# EAGLE design HSHV4-student versionTester (EAGLE 7.2.0)
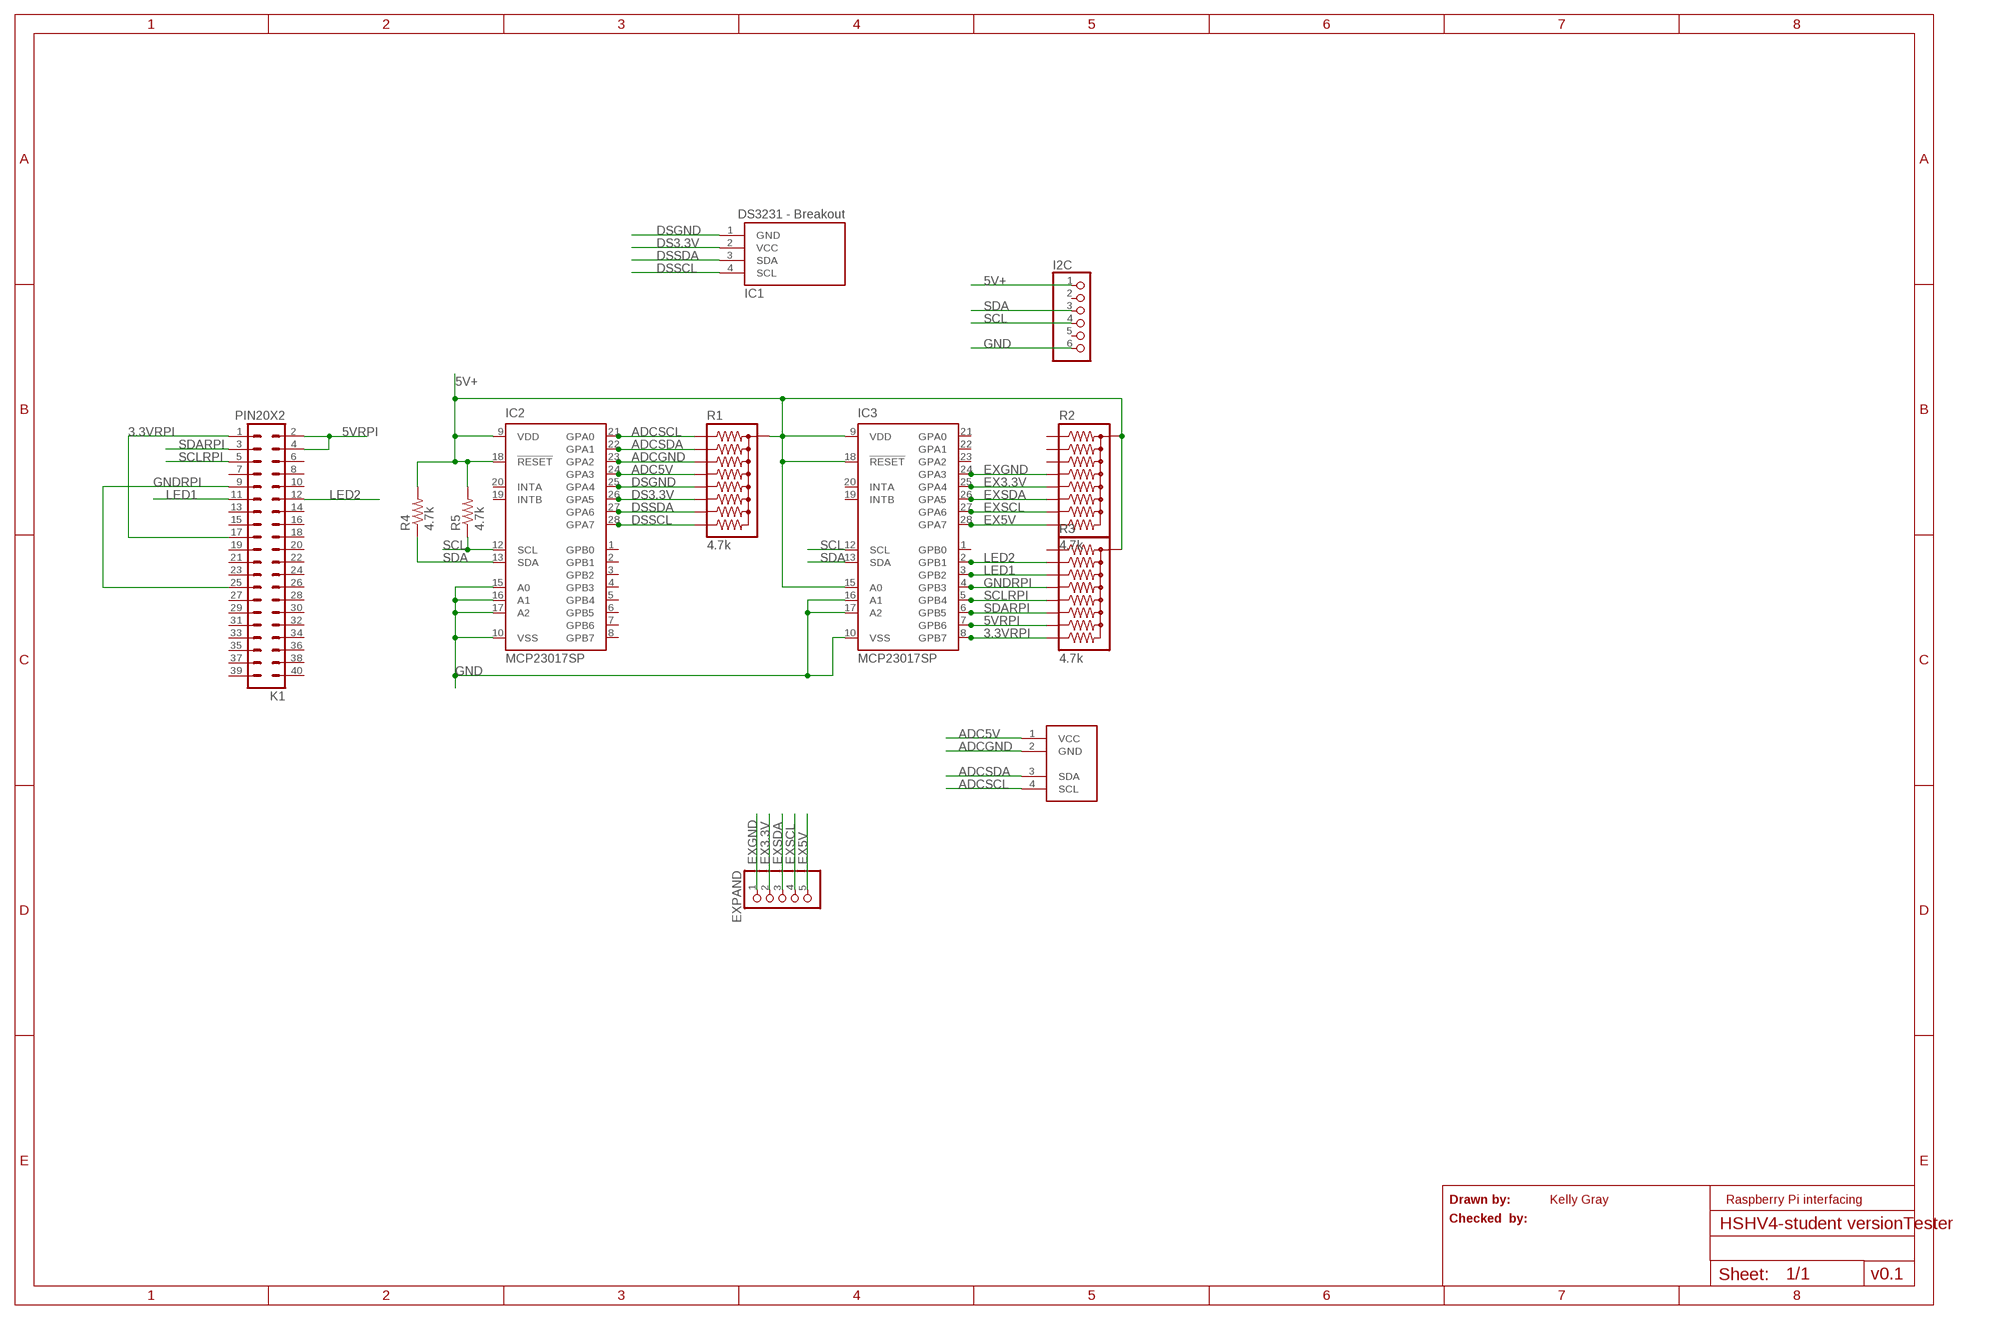
[diagram p0: schematic, sheet 1]

## Parts
EXPAND  PINHD-1X5  [1X05]
I2C  PINHD-1X6  [1X06]
IC1  DS3231  [8PTH]
IC2  MCP23017SP  [DIL28-3]
IC3  MCP23017SP  [DIL28-3]
K1  PIN20X2  [PIN_20X2]
R1  4.7k  RPACK-BUSSED-8-SIP-PTH-8  [RPACK-SIP-PTH-8]
R2  4.7k  RPACK-BUSSED-8-SIP-PTH-8  [RPACK-SIP-PTH-8]
R3  4.7k  RPACK-BUSSED-8-SIP-PTH-8  [RPACK-SIP-PTH-8]
R4  4.7k  R-US_0414/15  [0414/15]
R5  4.7k  R-US_0414/15  [0414/15]
U$1  PCF8591  [1X04]

## Nets
3.3VRPI: IC3.8(GPB7) K1.1 K1.17 R3.P$9
5V+: I2C.1 IC2.9(VDD) IC2.18(!RESET) IC3.9(VDD) IC3.15(A0) IC3.18(!RESET) R1.P$1 R2.P$1 R3.P$1 R4.2 R5.2
5VRPI: IC3.7(GPB6) K1.2 K1.4 R3.P$8
ADC5V: IC2.24(GPA3) R1.P$5 U$1.1(VCC)
ADCGND: IC2.23(GPA2) R1.P$4 U$1.2(GND)
ADCSCL: IC2.21(GPA0) R1.P$2 U$1.4(SCL)
ADCSDA: IC2.22(GPA1) R1.P$3 U$1.3(SDA)
DS3.3V: IC1.2(VCC) IC2.26(GPA5) R1.P$7
DSGND: IC1.1(GND) IC2.25(GPA4) R1.P$6
DSSCL: IC1.4(SCL) IC2.28(GPA7) R1.P$9
DSSDA: IC1.3(SDA) IC2.27(GPA6) R1.P$8
EX3.3V: EXPAND.2 IC3.25(GPA4) R2.P$6
EX5V: EXPAND.5 IC3.28(GPA7) R2.P$9
EXGND: EXPAND.1 IC3.24(GPA3) R2.P$5
EXSCL: EXPAND.4 IC3.27(GPA6) R2.P$8
EXSDA: EXPAND.3 IC3.26(GPA5) R2.P$7
GND: I2C.6 IC2.10(VSS) IC2.15(A0) IC2.16(A1) IC2.17(A2) IC3.10(VSS) IC3.16(A1) IC3.17(A2)
GNDRPI: IC3.4(GPB3) K1.9 K1.25 R3.P$5
LED1: IC3.3(GPB2) K1.11 R3.P$4
LED2: IC3.2(GPB1) K1.12 R3.P$3
SCL: I2C.4 IC2.12(SCL) IC3.12(SCL) R5.1
SCLRPI: IC3.5(GPB4) K1.5 R3.P$6
SDA: I2C.3 IC2.13(SDA) IC3.13(SDA) R4.1
SDARPI: IC3.6(GPB5) K1.3 R3.P$7
Unconnected: I2C.2 I2C.5 IC2.1(GPB0) IC2.2(GPB1) IC2.3(GPB2) IC2.4(GPB3) IC2.5(GPB4) IC2.6(GPB5) IC2.7(GPB6) IC2.8(GPB7) IC2.19(INTB) IC2.20(INTA) IC3.1(GPB0) IC3.19(INTB) IC3.20(INTA) IC3.21(GPA0) IC3.22(GPA1) IC3.23(GPA2) K1.6 K1.7 K1.8 K1.10 K1.13 K1.14 K1.15 K1.16 K1.18 K1.19 K1.20 K1.21 K1.22 K1.23 K1.24 K1.26 K1.27 K1.28 K1.29 K1.30 K1.31 K1.32 K1.33 K1.34 K1.35 K1.36 K1.37 K1.38 K1.39 K1.40 R2.P$2 R2.P$3 R2.P$4 R3.P$2

## Notes on the sheet
- Drawn by: | Kelly Gray | Raspberry Pi interfacing
- Checked  by:
- v0.1

## Library data of the parts
EXPAND = pinhead:PINHD-1X5: PIN HEADER
I2C = pinhead:PINHD-1X6: PIN HEADER
IC1 = SenseHat:DS3231
IC2 IC3 = adafruit:MCP23017: http://ww1.microchip.com/downloads/en/DeviceDoc/21952a.pdf Source: http://ww1.microchip.com/downloads/en/DeviceDoc/21952a.pdf
K1 = FLYFISH:PIN20X2
R1-R3 = SparkFun-Resistors:RPACK-BUSSED-8: BOURNS 4600X/R series thick-film SIP resistor packs Height resistors bussed to a single pin (denoted by dot). datasheet <http://dlnmh9ip6v2uc.cloudfront.net/datasheets/Components/General/4600x.pdf> SIMILAR TO: SFE parts COM-10855 (330), COM-10856 (10K)
R4 R5 = rcl:R-US_: RESISTOR, American symbol
U$1 = SenseHat:PCF8591

## Board
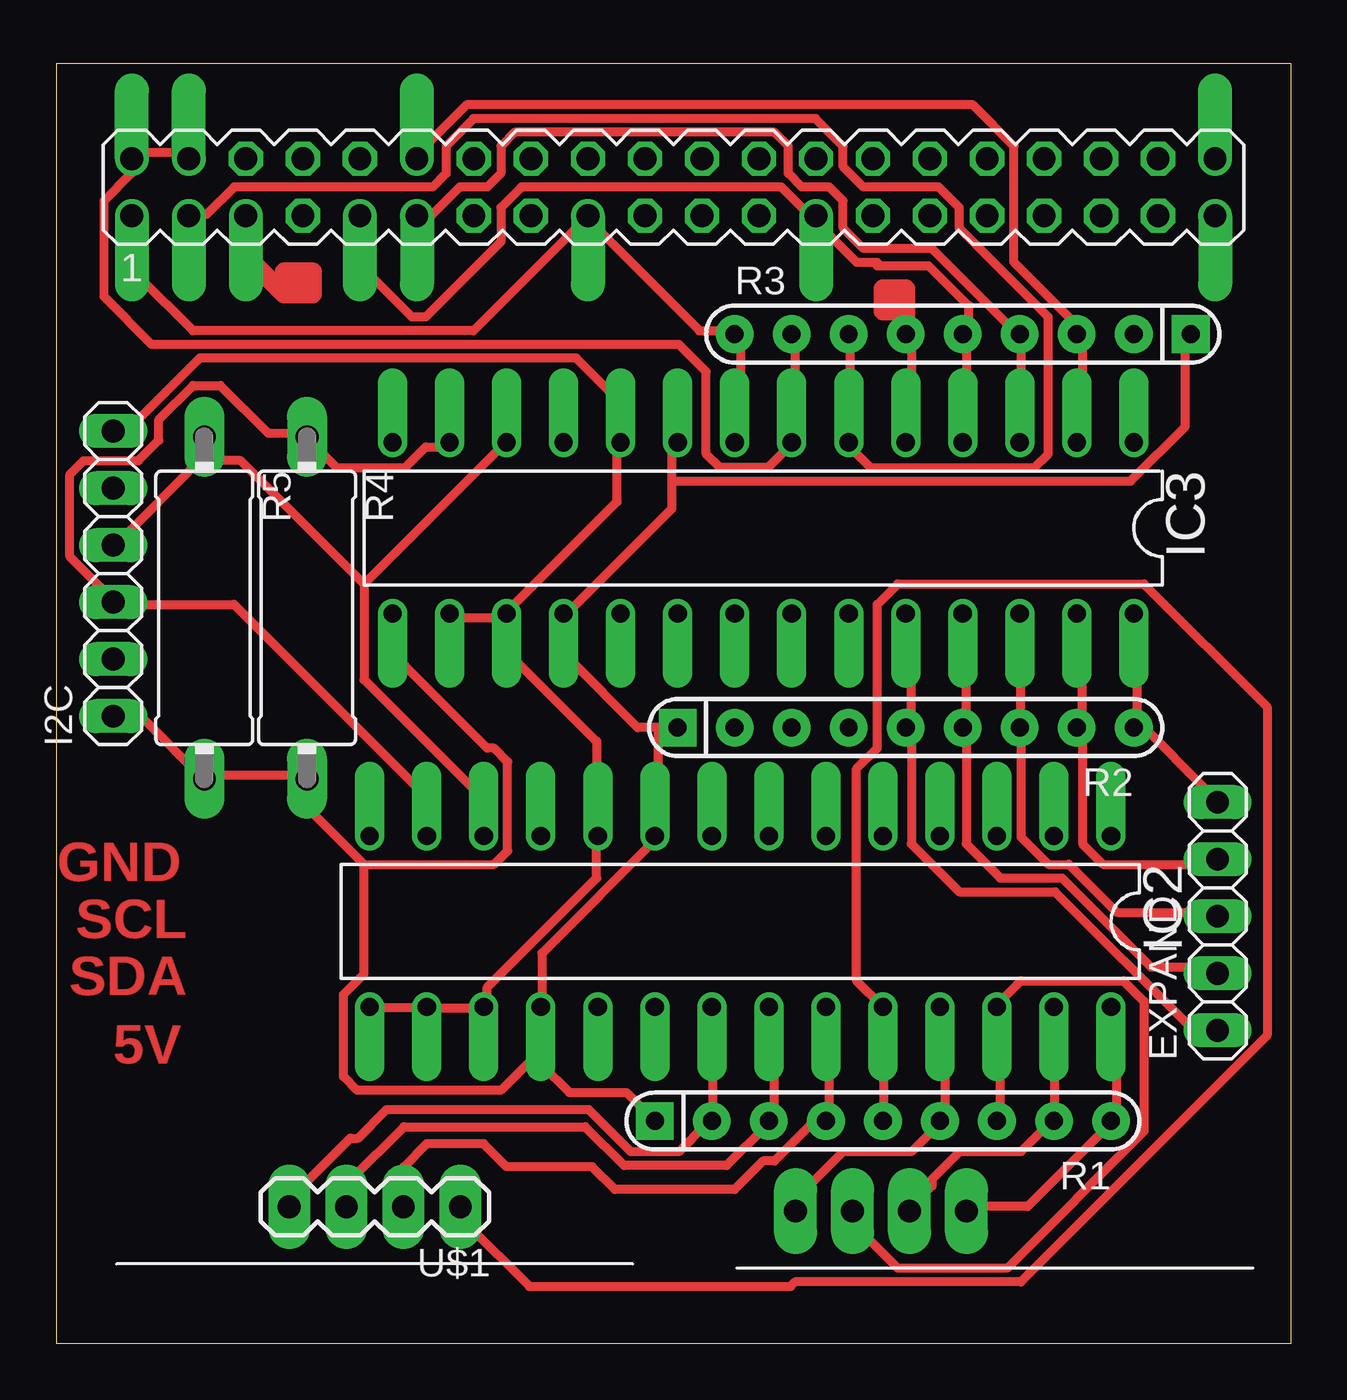
[diagram p1: board, top side]
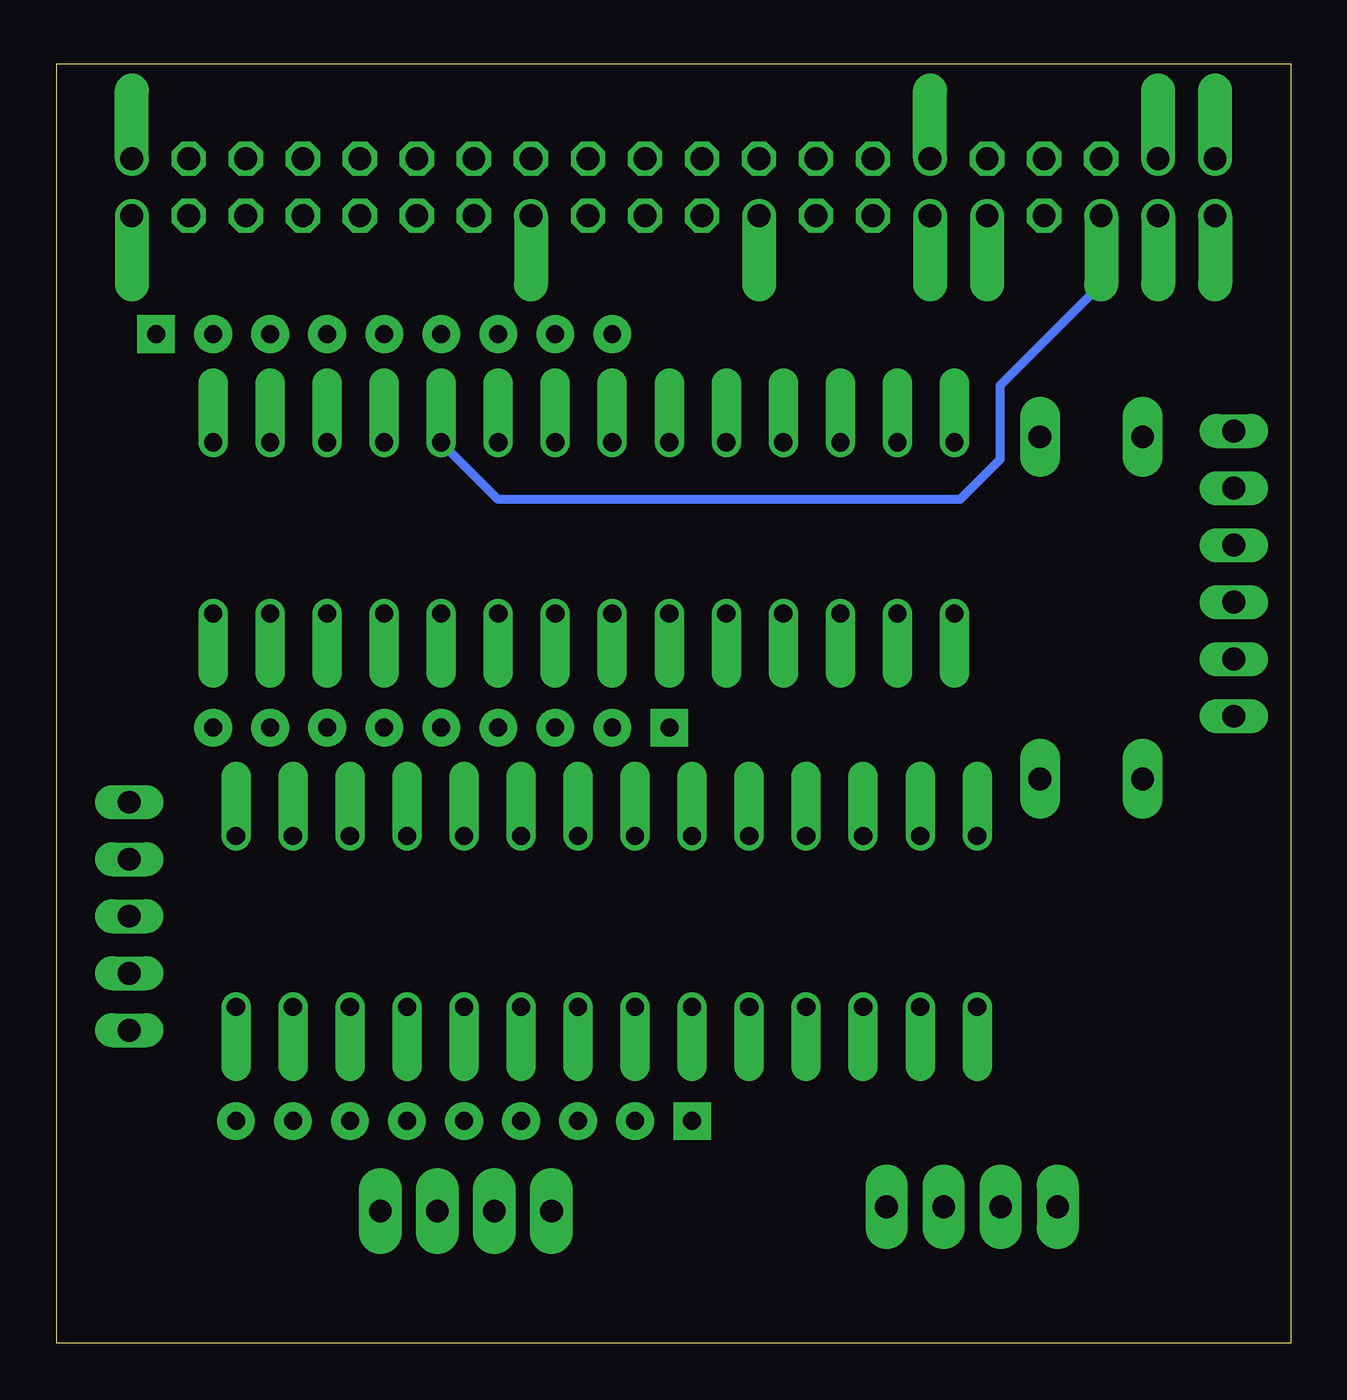
[diagram p2: board, bottom side, seen from below]

Size 55 x 57 mm. Coordinates in mm from the lower left corner, seen from the top.
Outline: 0,0 55,0 55,57 0,57 0,0
Copper layers (1*16): Top 0.035mm / dielectric 1.5mm / Bottom 0.035mm
Design rules "SparkFun *": minimum track width 16mil, minimum drill 20mil, track to track 8mil, track to pad 8mil, pad to pad 8mil, via to via 8mil, smd to smd 8mil, copper to edge 10mil, drill to drill 8mil, minimum pad ring 10mil, minimum via ring 10mil, stop-mask expansion 4mil, vias tented up to drill 25mil, thermal gap 10mil

### Footprints (pad centres in the part's own frame; a part is rotated, then mirrored left to right if it is on the bottom)
1X05 = drill 1.016 long: 1 -5.08,0; 2 -2.54,0; 3 0,0; 4 2.54,0; 5 5.08,0
1X06 = drill 1.016 long: 1 -6.35,0; 2 -3.81,0; 3 -1.27,0; 4 1.27,0; 5 3.81,0; 6 6.35,0
8PTH = drill 1.016 pad 1.905 long: 1 -3.81,0; 2 -1.27,0; 3 1.27,0; 4 3.81,0
DIL28-3 = drill 0.813 offset: 1 -16.51,-3.81; 2 -13.97,-3.81; 3 -11.43,-3.81; 4 -8.89,-3.81; 5 -6.35,-3.81; 6 -3.81,-3.81; 7 -1.27,-3.81; 8 1.27,-3.81; 9 3.81,-3.81; 10 6.35,-3.81; 11 8.89,-3.81; 12 11.43,-3.81; 13 13.97,-3.81; 14 16.51,-3.81; 15 16.51,3.81; 16 13.97,3.81; 17 11.43,3.81; 18 8.89,3.81; 19 6.35,3.81; 20 3.81,3.81; 21 1.27,3.81; 22 -1.27,3.81; 23 -3.81,3.81; 24 -6.35,3.81; 25 -8.89,3.81; 26 -11.43,3.81; 27 -13.97,3.81; 28 -16.51,3.81
PIN_20X2 = drill 1.016 offset: 1 -24.13,-1.27; 2 -24.13,1.27; 3 -21.59,-1.27; 4 -21.59,1.27; 5 -19.05,-1.27; 9 -13.97,-1.27; 11 -11.43,-1.27; 12 -11.43,1.27; 17 -3.81,-1.27; 25 6.35,-1.27; 39 24.13,-1.27; 40 24.13,1.27 | drill 1.016 octagon: 6 -19.05,1.27; 7 -16.51,-1.27; 8 -16.51,1.27; 10 -13.97,1.27; 13 -8.89,-1.27; 14 -8.89,1.27; 15 -6.35,-1.27; 16 -6.35,1.27; 18 -3.81,1.27; 19 -1.27,-1.27; 20 -1.27,1.27; 21 1.27,-1.27; 22 1.27,1.27; 23 3.81,-1.27; 24 3.81,1.27; 26 6.35,1.27; 27 8.89,-1.27; 28 8.89,1.27; 29 11.43,-1.27; 30 11.43,1.27; 31 13.97,-1.27; 32 13.97,1.27; 33 16.51,-1.27; 34 16.51,1.27; 35 19.05,-1.27; 36 19.05,1.27; 37 21.59,-1.27; 38 21.59,1.27
RPACK-SIP-PTH-8 = drill 0.8 pad 1.676 square: P$1 0,0 | drill 0.8 pad 1.676: P$2 0,-2.54; P$3 0,-5.08; P$4 0,-7.62; P$5 0,-10.16; P$6 0,-12.7; P$7 0,-15.24; P$8 0,-17.78; P$9 0,-20.32
0414/15 = drill 1.016 pad 1.778 long: 1 -7.62,0; 2 7.62,0
1X04 = drill 1.016 pad 1.88 long: 1 -3.81,0; 2 -1.27,0; 3 1.27,0; 4 3.81,0

### Placement (x,y rotation side)
EXPAND  51.74,19.03 90 top
I2C  2.54,34.29 90 top
IC1  36.75,5.9 0 top
IC2  30.48,18.8 180 top
IC3  31.5,36.32 180 top
K1  27.5,51.5 0 top
R1  26.67,9.91 90 top
R2  27.69,27.43 90 top
R3  50.55,44.96 270 top
R4  11.18,32.77 270 top
R5  6.6,32.77 270 top
U$1  14.2,6.08 180 top

### Tracks (layer width: path | path; a pad name or v marks a point on that pad's centre or on a via)
3.3VRPI
  Top 0.406: IC3.8 30.48,40.23 30.48,44.81 R3.P$9 30.18,45.11 28.65,45.11 23.77,49.99 K1.17 23.47,49.99 18.59,45.11 6.1,45.11 3.66,47.55 3.66,49.99 K1.1
5V+
  Top 0.406: I2C.1 2.74,27.74 3.96,27.74 6.4,25.3 R5.2 6.71,25.3 10.97,25.3 R4.2 11.28,24.99 11.28,23.77 13.72,21.34 | 13.72,21.34 19.51,21.34 20.12,21.95 20.12,25.91 19.51,26.52 19.2,26.52 15.24,30.48 15.24,32.31 IC3.15 | 21.64,13.11 21.64,14.94 IC2.18 | 26.52,10.06 R1.P$1 25.4,11.18 22.86,11.18 21.64,12.39 21.64,13.11 | R2.P$1 26.82,27.43 | 26.82,27.43 25.91,27.43 22.86,30.48 22.86,32.31 IC3.18 22.86,32.61 27.43,37.19 27.43,38.41 | 26.82,27.43 26.82,22.86 IC2.9 26.82,22.55 21.64,17.37 21.64,15.24 IC2.18 | 27.43,38.41 27.43,39.93 IC3.9 | 27.43,38.41 47.85,38.41 50.29,40.84 50.29,44.81 R3.P$1 | 13.72,21.34 13.72,16.46 12.8,15.54 12.8,11.89 13.41,11.28 19.81,11.28 21.64,13.11 | 21.64,13.11 IC2.18
5VRPI
  Top 0.406: K1.4 5.79,53.03 3.66,53.03 K1.2 3.35,52.73 3.35,52.12 2.13,50.9 2.13,46.63 4.27,44.5 27.74,44.5 28.96,43.28 28.96,39.62 29.57,39.01 31.7,39.01 32.61,39.93 IC3.7 32.92,40.23 32.92,44.81 R3.P$8
ADC5V
  Top 0.406: R1.P$5 36.88,10.06 36.88,14.94 IC2.24 35.66,16.15 35.66,25.6 36.58,26.52 36.58,32.92 37.49,33.83 48.46,33.83 53.95,28.35 53.95,13.72 42.98,2.74 32.92,2.74 32.72,2.54 21.08,2.54 18.29,5.33 18.29,5.79 U$1.1
ADCGND
  Top 0.406: IC2.23 34.44,14.94 34.44,10.06 R1.P$4 33.78,9.91 32,8.13 31.5,8.13 30.23,6.86 24.89,6.86 23.88,7.87 20.07,7.87 19.05,8.89 16.51,8.89 15.49,7.87 15.49,6.11 U$1.2
ADCSCL
  Top 0.406: IC2.21 29.26,14.94 29.26,10.06 R1.P$2 28.96,9.75 27.74,8.53 25.6,8.53 23.72,10.41 14.73,10.41 13.46,9.14 13.11,9.14 10.67,6.71 10.67,6.1 U$1.4
ADCSDA
  Top 0.406: IC2.22 32,14.94 32,10.06 R1.P$3 31.7,9.75 29.87,7.92 25.3,7.92 23.57,9.65 15.49,9.65 13.11,7.26 13.11,6.1 U$1.3
DS3.3V
  Top 0.406: R1.P$7 42.06,10.06 42.06,14.94 IC2.26 42.06,15.24 42.98,16.15 47.55,16.15 48.46,15.24 48.46,9.45 42.37,3.35 37.49,3.35 35.66,5.18 35.66,5.79 IC1.2
DSGND
  Top 0.406: IC2.25 39.62,14.94 39.62,10.06 R1.P$6 39.32,9.75 38.1,8.53 35.05,8.53 33.22,6.71 33.22,6.1 IC1.1
DSSCL
  Top 0.406: IC2.28 47.24,14.94 47.24,10.06 R1.P$9 46.94,9.75 43.28,6.1 40.84,6.1 IC1.4
DSSDA
  Top 0.406: IC2.27 44.5,14.94 44.5,10.06 R1.P$8 44.2,9.75 42.98,8.53 40.23,8.53 39.01,7.32 39.01,7.01 38.1,6.1 IC1.3
EX3.3V
  Top 0.406: 40.54,27.43 40.54,32.31 IC3.25 | 40.54,27.43 40.54,22.25 42.06,20.73 44.81,20.73 48.77,16.76 51.51,16.76 EXPAND.2 | 40.54,27.43 R2.P$6
EX5V
  Top 0.406: 48.16,27.74 48.16,27.43 R2.P$9 48.16,27.74 | 48.16,27.74 48.16,32.31 IC3.28 | 48.16,27.74 51.51,24.38 EXPAND.5
EXGND
  Top 0.406: 38.1,27.43 38.1,32.31 IC3.24 | 38.1,27.43 38.1,22.25 40.23,20.12 44.5,20.12 50.6,14.02 51.51,14.02 EXPAND.1 | 38.1,27.43 R2.P$5
EXSCL
  Top 0.406: 45.72,27.43 45.72,32.31 IC3.27 | 45.72,27.43 45.72,22.25 46.63,21.34 51.51,21.34 EXPAND.4 | 45.72,27.43 R2.P$8
EXSDA
  Top 0.406: 42.98,27.43 42.98,32.31 IC3.26 | 42.98,27.43 42.98,22.55 44.2,21.34 45.11,21.34 47.24,19.2 51.51,19.2 EXPAND.3 | 42.98,27.43 R2.P$7
GND
  Top 0.406: IC2.15 14.02,14.94 16.46,14.94 IC2.16 16.76,14.94 18.9,14.94 IC2.17 19.2,15.24 19.2,15.85 24.08,20.73 24.08,22.55 IC2.10 24.08,22.86 24.08,26.82 20.12,30.79 20.12,32.31 IC3.17 | IC3.16 17.68,32.31 19.81,32.31 IC3.17 | IC3.17 20.12,32.61 24.99,37.49 24.99,39.93 IC3.10 24.99,40.23 24.99,42.06 23.16,43.89 6.4,43.89 3.35,40.84 2.74,40.84 I2C.6
GNDRPI
  Top 0.406: IC3.4 40.54,40.23 40.54,44.81 R3.P$5 40.64,44.96 40.64,46.23 38.86,48.01 36.58,48.01 36.58,48.16 35.66,48.16 33.83,49.99 | 33.83,49.99 32.31,51.51 20.73,51.51 19.81,50.6 19.81,49.07 16.46,45.72 15.85,45.72 13.72,47.85 13.72,49.99 K1.9 | 33.83,49.99 K1.25
LED1
  Top 0.406: IC3.3 42.98,40.23 42.98,44.81 R3.P$4 42.67,45.11 39.01,48.77 35.97,48.77 35.05,49.68 35.05,50.9 34.44,51.51 33.22,51.51 32.61,52.12 32.61,53.34 32,53.95 20.42,53.95 19.81,53.34 19.81,52.12 19.2,51.51 17.98,51.51 16.76,50.29 16.15,50.29 K1.11
LED2
  Top 0.406: IC3.2 45.72,40.23 45.72,44.81 R3.P$3 45.72,45.11 42.67,48.16 42.67,53.34 40.84,55.17 18.29,55.17 16.15,53.03 K1.12
SCL
  Top 0.406: 6.4,39.32 2.74,35.66 I2C.4 | 6.4,39.32 6.4,40.23 R5.1 6.4,39.32 | 13.72,33.83 13.72,29.57 18.9,24.38 18.9,22.86 IC2.12 | 13.72,33.83 19.81,39.93 IC3.12 | 6.4,39.32 8.23,39.32 13.72,33.83
SCLRPI
  Top 0.406: IC3.5 38.1,40.23 38.1,44.81 R3.P$6
  Top 0.813: 37.85,45.97 37.85,46.99 36.83,46.99 36.83,45.97 37.85,45.97 | R3.P$6 37.85,45.97 | 37.85,45.97 37.34,46.48 | K1.5 8.45,48.45 10.16,46.74 | 10.16,46.74 11.43,46.74 11.43,47.75 10.16,47.75 10.16,46.99 | 10.16,46.74 10.16,46.99 | 10.16,46.99 10.67,47.5 10.92,47.24
  Bottom 0.406: K1.5 8.45,47.18 12.95,42.67 12.95,39.37 14.73,37.59 35.31,37.59 IC3.5
SDA
  Top 0.406: IC3.13 17.37,39.93 16.46,39.93 15.54,39.01 12.5,39.01 11.28,40.23 R4.1 10.97,40.54 9.45,40.54 7.32,42.67 6.1,42.67 4.57,41.15 4.57,40.23 3.66,39.32 1.22,39.32 0.61,38.71 0.61,35.05 2.44,33.22 I2C.3 2.74,32.92 7.92,32.92 16.46,24.38 16.46,22.86 IC2.13
SDARPI
  Top 0.406: R3.P$7 35.36,44.81 35.36,40.23 IC3.6 35.36,39.93 36.27,39.01 43.59,39.01 44.2,39.62 44.2,45.72 40.23,49.68 40.23,50.6 39.32,51.51 35.97,51.51 35.05,52.43 35.05,53.34 33.83,54.56 18.59,54.56 17.37,53.34 17.37,52.12 16.76,51.51 7.92,51.51 6.71,50.29 6.1,50.29 K1.3

### Text on the board
Top: GND | SCL | SDA | 5V